# EAGLE design MQTTGateWay (EAGLE 7.2.0)
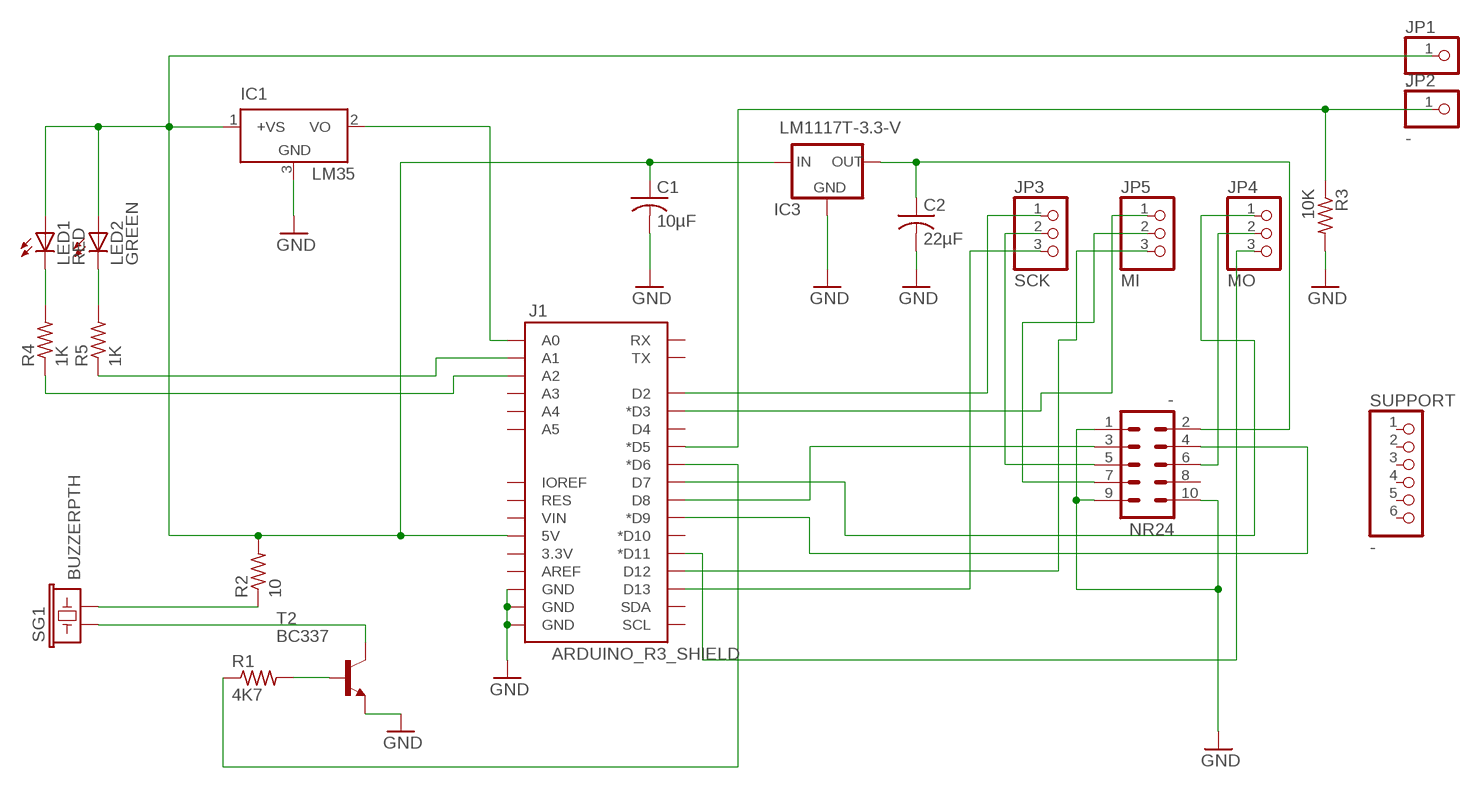
[diagram p0: schematic, sheet 1]

## Parts
C1  10µF  C-US025-024X044  [C025-024X044]
C2  22µF  C-US025-024X044  [C025-024X044]
IC1  LM35  LM35CZ  [TO92]
IC3  LM1117T-3.3-V  [TO220V]
J1  ARDUINO_R3_SHIELD  [UNO_R3_SHIELD]
JP1  -  PINHD-1X1  [1X01]
JP2  -  PINHD-1X1  [1X01]
JP3  SCK  PINHD-1X3  [1X03]
JP4  MO  PINHD-1X3  [1X03]
JP5  MI  PINHD-1X3  [1X03]
LED1  RED  LED3MM  [LED3MM]
LED2  GREEN  LED3MM  [LED3MM]
NR24  -  MA05-2  [MA05-2]
R1  4K7  R-US_0207/10  [0207/10]
R2  10  R-US_0207/10  [0207/10]
R3  10K  R-US_0207/10  [0207/10]
R4  1K  R-US_0207/10  [0207/10]
R5  1K  R-US_0207/10  [0207/10]
SG1  BUZZERPTH  [BUZZER-12MM]
SUPPORT  -  PINHD-1X6  [1X06]
T2  BC337  [TO92]

## Nets
GND: C1.2 C2.2 IC1.3(GND) IC3.1(GND) J1.GND@0(GND) J1.GND@1(GND) J1.GND@2(GND) NR24.1 NR24.9 NR24.10 R3.2 T2.1(E)
MISO: J1.D3(*D3) JP5.1
MOSI: J1.D7 JP4.1
N$1: J1.D5(*D5) JP2.1 R3.1
N$2: R1.2 T2.2(B)
N$3: C2.1 IC3.2(OUT) NR24.2
N$4: J1.D8 NR24.3
N$5: J1.D9(*D9) NR24.4
N$6: JP4.2 NR24.6
N$7: JP5.2 NR24.7
N$8: J1.D13 JP3.3
N$9: J1.D12 JP5.3
N$10: J1.D11(*D11) JP4.3
N$11: R2.1 SG1.-
N$12: SG1.+ T2.3(C)
N$13: J1.D6(*D6) R1.1
N$14: LED1.K(C) R4.2
N$15: IC1.2(VO) J1.A0
N$16: LED2.K(C) R5.2
N$17: J1.A1 R5.1
N$18: J1.A2 R4.1
SCK: JP3.2 NR24.5
SSCK: J1.D2 JP3.1
VCC: C1.1 IC1.1(+VS) IC3.3(IN) J1.5V JP1.1 LED1.A LED2.A R2.2
Unconnected: J1.3.3V J1.A3 J1.A4 J1.A5 J1.AREF J1.D4 J1.D10(*D10) J1.IOREF J1.RES J1.RX J1.SCL J1.SDA J1.TX J1.VIN NR24.8 SUPPORT.1 SUPPORT.2 SUPPORT.3 SUPPORT.4 SUPPORT.5 SUPPORT.6

## Library data of the parts
C1 C2 = adafruit:C-US: CAPACITOR, American symbol
IC1 = lm35:LM35: Single-Supply Centigrade Temperature Sensor Vout = (10mV/°C x Temp °C) +5mmmV Source: http://www.national.com/ds/LM/LM35.pdf
IC3 = lm1117:LM1117T-*
J1 = SparkFun-Boards:ARDUINO_R3_SHIELD: Shield form compatible with the Arduino Uno R3.
JP1 JP2 = adafruit:PINHD-1X1: Pin header 1x1 for 0.1" spacing With round pins
JP3-JP5 = adafruit:PINHD-1X3: PIN HEADER
LED1 LED2 = adafruit:LED: LED OSRAM: - CHIPLED LG R971, LG N971, LY N971, LG Q971, LY Q971, LO R971, LY R971 LH N974, LH R974 LS Q976, LO Q976, LY Q976 LO Q996 - Hyper CHIPLED LW Q18S LB Q993, LB Q99A, LB R99A - SideLED LS A670, LO A670, LY A670, LG A670, LP A670 LB A673, LV A673, LT A673, LW A673 LH A674 LY A675 LS A676, LA A676, LO A676, LY A676, LW A676 LS A679, LY A679, LG A679 - Hyper Micro SIDELED® LS Y876, LA Y876, LO Y876, LY Y876 LT Y87S - SmartLED LW L88C, LW L88S LB L89C, LB L89S, LG L890 LS L89K, LO L89K, LY L89K LS L896, LA L896, LO L896, LY L896 - TOPLED LS T670, LO T670, LY T670, LG T670, LP T670 LSG T670, LSP T670, LSY T670, LOP T670, LYG T670 LG T671, LOG T671, LSG T671 LB T673, LV T673, LT T673, LW T673 LH T674 LS T676, LA T676, LO T676, LY T676, LB T676, LH T676, LSB T676, LW T676 LB T67C, LV T67C, LT T67C, LS T67K, LO T67K, LY T67K, LW E67C LS E67B, LA E67B, LO E67B, LY E67B, LB E67C, LV E67C, LT E67C LW T67C LS T679, LY T679, LG T679 LS T770, LO T770, LY T770, LG T770, LP T770 LB T773, LV T773, LT T773, LW T773 LH T774 LS E675, LA E675, LY E675, LS T675 LS T776, LA T776, LO T776, LY T776, LB T776 LHGB T686 LT T68C, LB T68C - Hyper Mini TOPLED® LB M676 - Mini TOPLED Santana® LG M470 LS M47K, LO M47K, LY M47K Source: http://www.osram.convergy.de/
NR24 = con-lstb:MA05-2: PIN HEADER; OC_FARNELL: unknown; OC_NEWARK: unknown
R1-R5 = adafruit:R-US_: RESISTOR, American symbol
SG1 = SparkFun-Electromechanical:BUZZER: Buzzer 12mm Spark Fun Electronics SKU : Comp-Buzzer
SUPPORT = adafruit:PINHD-1X6: PIN HEADER
T2 = transistor:BC337: NPN TRANSISTOR

## Board
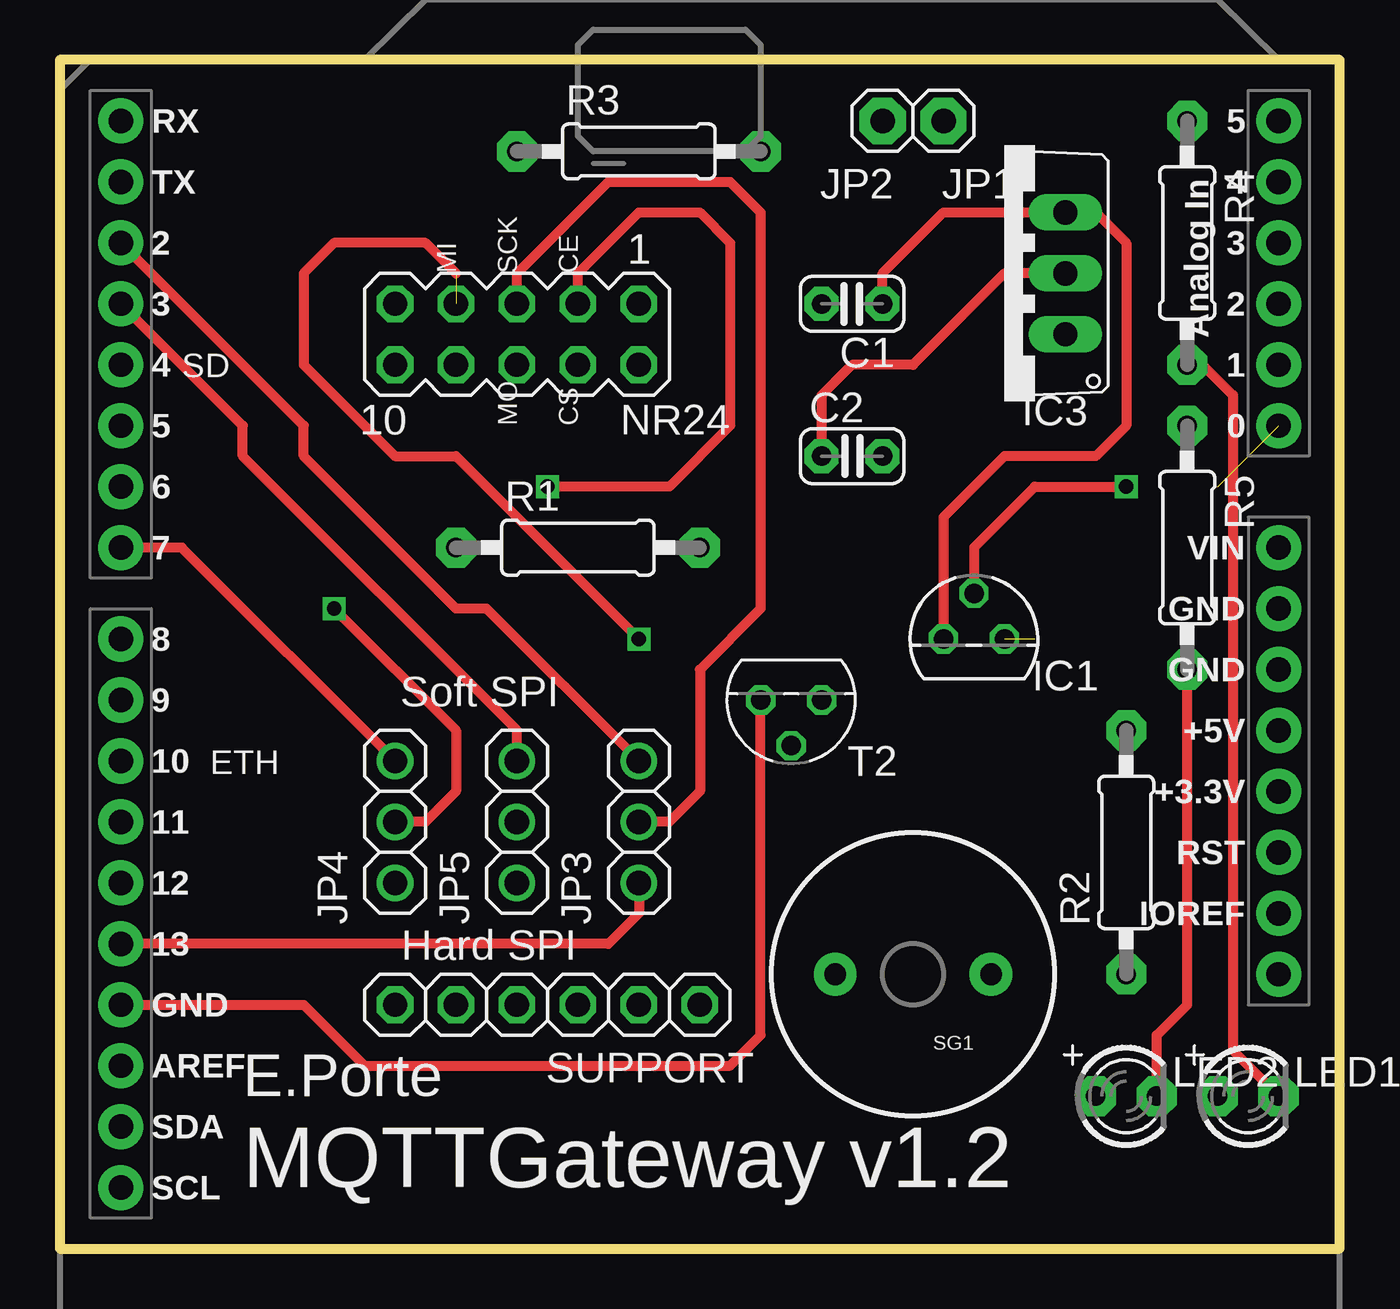
[diagram p1: board, top side]
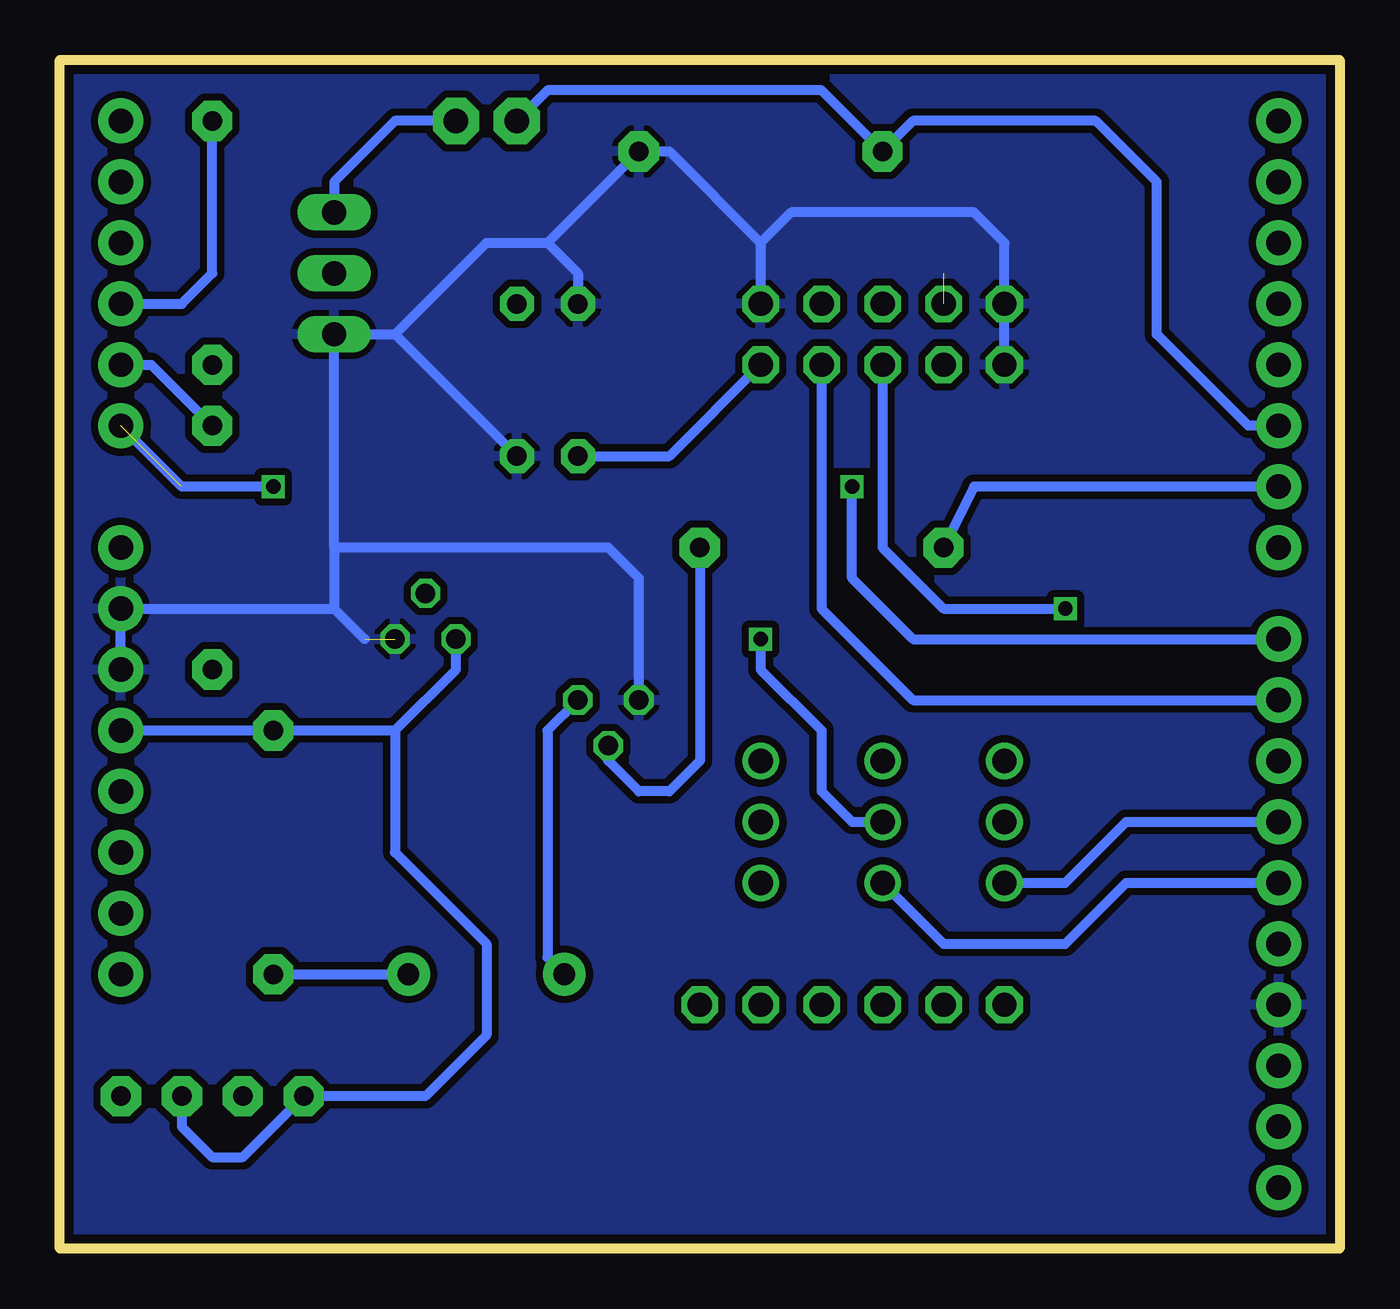
[diagram p2: board, bottom side, seen from below]

Size 53.34 x 49.53 mm. Coordinates in mm from the lower left corner, seen from the top.
Outline: 0,0 53.34,0 53.34,49.53 0,49.53 0,0
Copper layers (1*16): Top 0.0356mm / dielectric 1.5011mm / Bottom 0.0356mm
Design rules "LaenPCBOrder": minimum track width 6mil, minimum drill 13mil, track to track 6mil, track to pad 6mil, pad to pad 6mil, via to via 6mil, smd to smd 6mil, copper to edge 15mil, drill to drill 6mil, minimum pad ring 7mil, minimum via ring 7mil, stop-mask expansion 3mil, vias tented up to drill 0mil, thermal gap 10mil

### Footprints (pad centres in the part's own frame; a part is rotated, then mirrored left to right if it is on the bottom)
C025-024X044 = drill 0.813 pad 1.422 octagon: 1 -1.27,0; 2 1.27,0
TO92 = drill 0.813 octagon: 1 -1.27,0; 2 0,1.905; 3 1.27,0
TO220V = drill 1.016 long: 1 -2.54,-2.54; 2 0,-2.54; 3 2.54,-2.54
UNO_R3_SHIELD = drill 1.016 pad 1.88: 3.3V 50.8,26.67; 5V 50.8,29.21; A0 50.8,41.91; A1 50.8,44.45; A2 50.8,46.99; A3 50.8,49.53; A4 50.8,52.07; A5 50.8,54.61; AREF 2.54,15.24; D2 2.54,49.53; D3 2.54,46.99; D4 2.54,44.45; D5 2.54,41.91; D6 2.54,39.37; D7 2.54,36.83; D8 2.54,33.02; D9 2.54,30.48; D10 2.54,27.94; D11 2.54,25.4; D12 2.54,22.86; D13 2.54,20.32; GND@0 50.8,31.75; GND@1 50.8,34.29; GND@2 2.54,17.78; IOREF 50.8,21.59; NC 50.8,19.05; RES 50.8,24.13; RX 2.54,54.61; SCL 2.54,10.16; SDA 2.54,12.7; TX 2.54,52.07; VIN 50.8,36.83
1X01 = drill 1.016 pad 1.93 octagon: 1 0,0
1X03 = drill 1.016: 1 -2.54,0; 2 0,0; 3 2.54,0
LED3MM = drill 0.813 pad 1.676 octagon: A -1.27,0; K 1.27,0
MA05-2 = drill 1.016 octagon: 1 -5.08,-1.27; 2 -5.08,1.27; 3 -2.54,-1.27; 4 -2.54,1.27; 5 0,-1.27; 6 0,1.27; 7 2.54,-1.27; 8 2.54,1.27; 9 5.08,-1.27; 10 5.08,1.27
0207/10 = drill 0.813 pad 1.676 octagon: 1 -5.08,0; 2 5.08,0
BUZZER-12MM = drill 0.9 pad 1.778: + 3.25,0; - -3.25,0
1X06 = drill 1.016 octagon: 1 -6.35,0; 2 -3.81,0; 3 -1.27,0; 4 1.27,0; 5 3.81,0; 6 6.35,0
TO92' = drill 0.813 octagon: 1 1.27,0; 2 0,1.905; 3 -1.27,0

### Placement (x,y rotation side)
C1  33.02,39.37 180 top
C2  33.02,33.02 0 top
IC1  38.1,25.4 0 top
IC3  39.37,40.64 90 top
J1  0,-7.62 0 top
JP1  36.83,46.99 0 top
JP2  34.29,46.99 0 top
JP3  24.13,17.78 270 top
JP4  13.97,17.78 270 top
JP5  19.05,17.78 270 top
LED1  49.53,6.35 0 top
LED2  44.45,6.35 0 top
NR24  19.05,38.1 180 top
R1  21.59,29.21 0 top
R2  44.45,16.51 90 top
R3  24.13,45.72 0 top
R4  46.99,41.91 270 top
R5  46.99,29.21 270 top
SG1  35.56,11.43 180 top
SUPPORT  20.32,10.16 0 top
T2  BC337  [TO92']  30.48,22.86 180 top

### Tracks (layer width: path | path; a pad name or v marks a point on that pad's centre or on a via)
GND  (1 unrouted)
  Top 0.406: J1.GND@2 10.16,10.16 12.7,7.62 27.94,7.62 29.21,8.89 T2.1
  Bottom 0.406: 41.91,29.21 41.91,26.67 | 41.91,26.67 40.64,25.4 | T2.1 29.21,27.94 30.48,29.21 41.91,29.21 | 41.91,26.67 J1.GND@1 J1.GND@0 | 41.91,29.21 IC3.1 39.37,38.1 | 33.02,41.91 R3.2 27.94,45.72 24.13,41.91 | 24.13,41.91 NR24.1 | NR24.10 NR24.9 13.97,41.91 15.24,43.18 22.86,43.18 24.13,41.91 | 39.37,38.1 35.56,41.91 33.02,41.91 | 33.02,41.91 31.75,40.64 C1.2 | C2.2 39.37,38.1
  pour Bottom (isolate 0.305): 0,49.53 53.34,49.53 53.34,0 0,0
MISO
  Top 0.406: JP5.1 19.05,21.59 7.62,33.02 7.62,34.29 J1.D3
MOSI
  Top 0.406: J1.D7 5.08,29.21 JP4.1
N$1
  Bottom 0.406: JP2.1 33.02,48.26 21.59,48.26 R3.1 17.78,46.99 10.16,46.99 7.62,44.45 7.62,38.1 3.81,34.29 J1.D5
N$2
  Bottom 0.406: R1.2 26.67,20.32 27.94,19.05 29.21,19.05 30.48,20.32 T2.2
N$3
  Top 0.406: IC3.2 39.37,40.64 35.56,36.83 33.02,36.83 31.75,35.56 C2.1
  Bottom 0.406: C2.1 27.94,33.02 NR24.2
N$4  (via drill 0.6)
  Top 0.406: NR24.3 21.59,40.64 24.13,43.18 26.67,43.18 27.94,41.91 27.94,34.29 25.4,31.75 v20.32,31.75
  Bottom 0.406: J1.D8 17.78,25.4 20.32,27.94 v20.32,31.75
N$5
  Bottom 0.406: NR24.4 21.59,26.67 17.78,22.86 J1.D9
N$6  (via drill 0.6)
  Top 0.406: v11.43,26.67 16.51,21.59 16.51,19.05 15.24,17.78 JP4.2
  Bottom 0.406: NR24.6 19.05,29.21 16.51,26.67 v11.43,26.67
N$7  (via drill 0.6)  (1 unrouted)
  Top 0.406: 16.51,40.64 15.24,41.91 11.43,41.91 10.16,40.64 10.16,36.83 13.97,33.02 16.51,33.02 v24.13,25.4
  Bottom 0.406: v24.13,25.4 24.13,24.13 21.59,21.59 21.59,19.05 20.32,17.78 JP5.2
N$8
  Top 0.406: JP3.3 24.13,13.97 22.86,12.7 J1.D13
N$9
  Bottom 0.406: JP5.3 16.51,12.7 11.43,12.7 8.89,15.24 J1.D12
N$10
  Bottom 0.406: JP4.3 11.43,15.24 8.89,17.78 J1.D11
N$11
  Bottom 0.406: R2.1 SG1.-
N$12
  Bottom 0.406: T2.3 33.02,21.59 33.02,12.14 SG1.+
N$13
  Bottom 0.406: J1.D6 15.24,31.75 R1.1
N$14
  Top 0.406: R4.2 47.62,36.83 48.89,35.56 48.89,8.26 LED1.K
N$15  (via drill 0.6)  (1 unrouted)
  Top 0.406: IC1.2 38.1,29.21 40.64,31.75 v44.45,31.75
  Bottom 0.406: v44.45,31.75 48.26,31.75 J1.A0
N$16
  Top 0.406: LED2.K 45.72,8.89 46.99,10.16 R5.2
N$17
  Bottom 0.406: J1.A1 49.53,36.83 R5.1
N$18
  Bottom 0.406: J1.A2 48.26,39.37 46.99,40.64 R4.1
SCK
  Top 0.406: NR24.5 19.05,40.64 22.86,44.45 27.94,44.45 29.21,43.18 29.21,26.67 26.67,24.13 26.67,19.05 25.4,17.78 JP3.2
SSCK
  Top 0.406: JP3.1 17.78,26.67 16.51,26.67 10.16,33.02 10.16,34.29 J1.D2
VCC
  Top 0.406: IC1.1 36.83,30.48 39.37,33.02 43.18,33.02 44.45,34.29 44.45,41.91 43.18,43.18 IC3.3 36.83,43.18 34.29,40.64 C1.1
  Bottom 0.406: JP1.1 39.37,46.99 41.91,44.45 IC3.3 | J1.5V R2.2 39.37,21.59 | 39.37,21.59 36.83,24.13 IC1.1 | LED1.A 48.26,5.08 46.99,3.81 45.72,3.81 LED2.A 38.1,6.35 35.56,8.89 35.56,12.7 39.37,16.51 39.37,21.59

### Text on the board
tPlace: MI | SCK | CE | SD | MO | CS | Soft SPI | ETH | Hard SPI | E.Porte | MQTTGateway v1.2
tValues: GND | GND | GND | GND | VCC